# Altium schematic sheet AVR Board 4.0 FTDI USB.SchDoc
size B
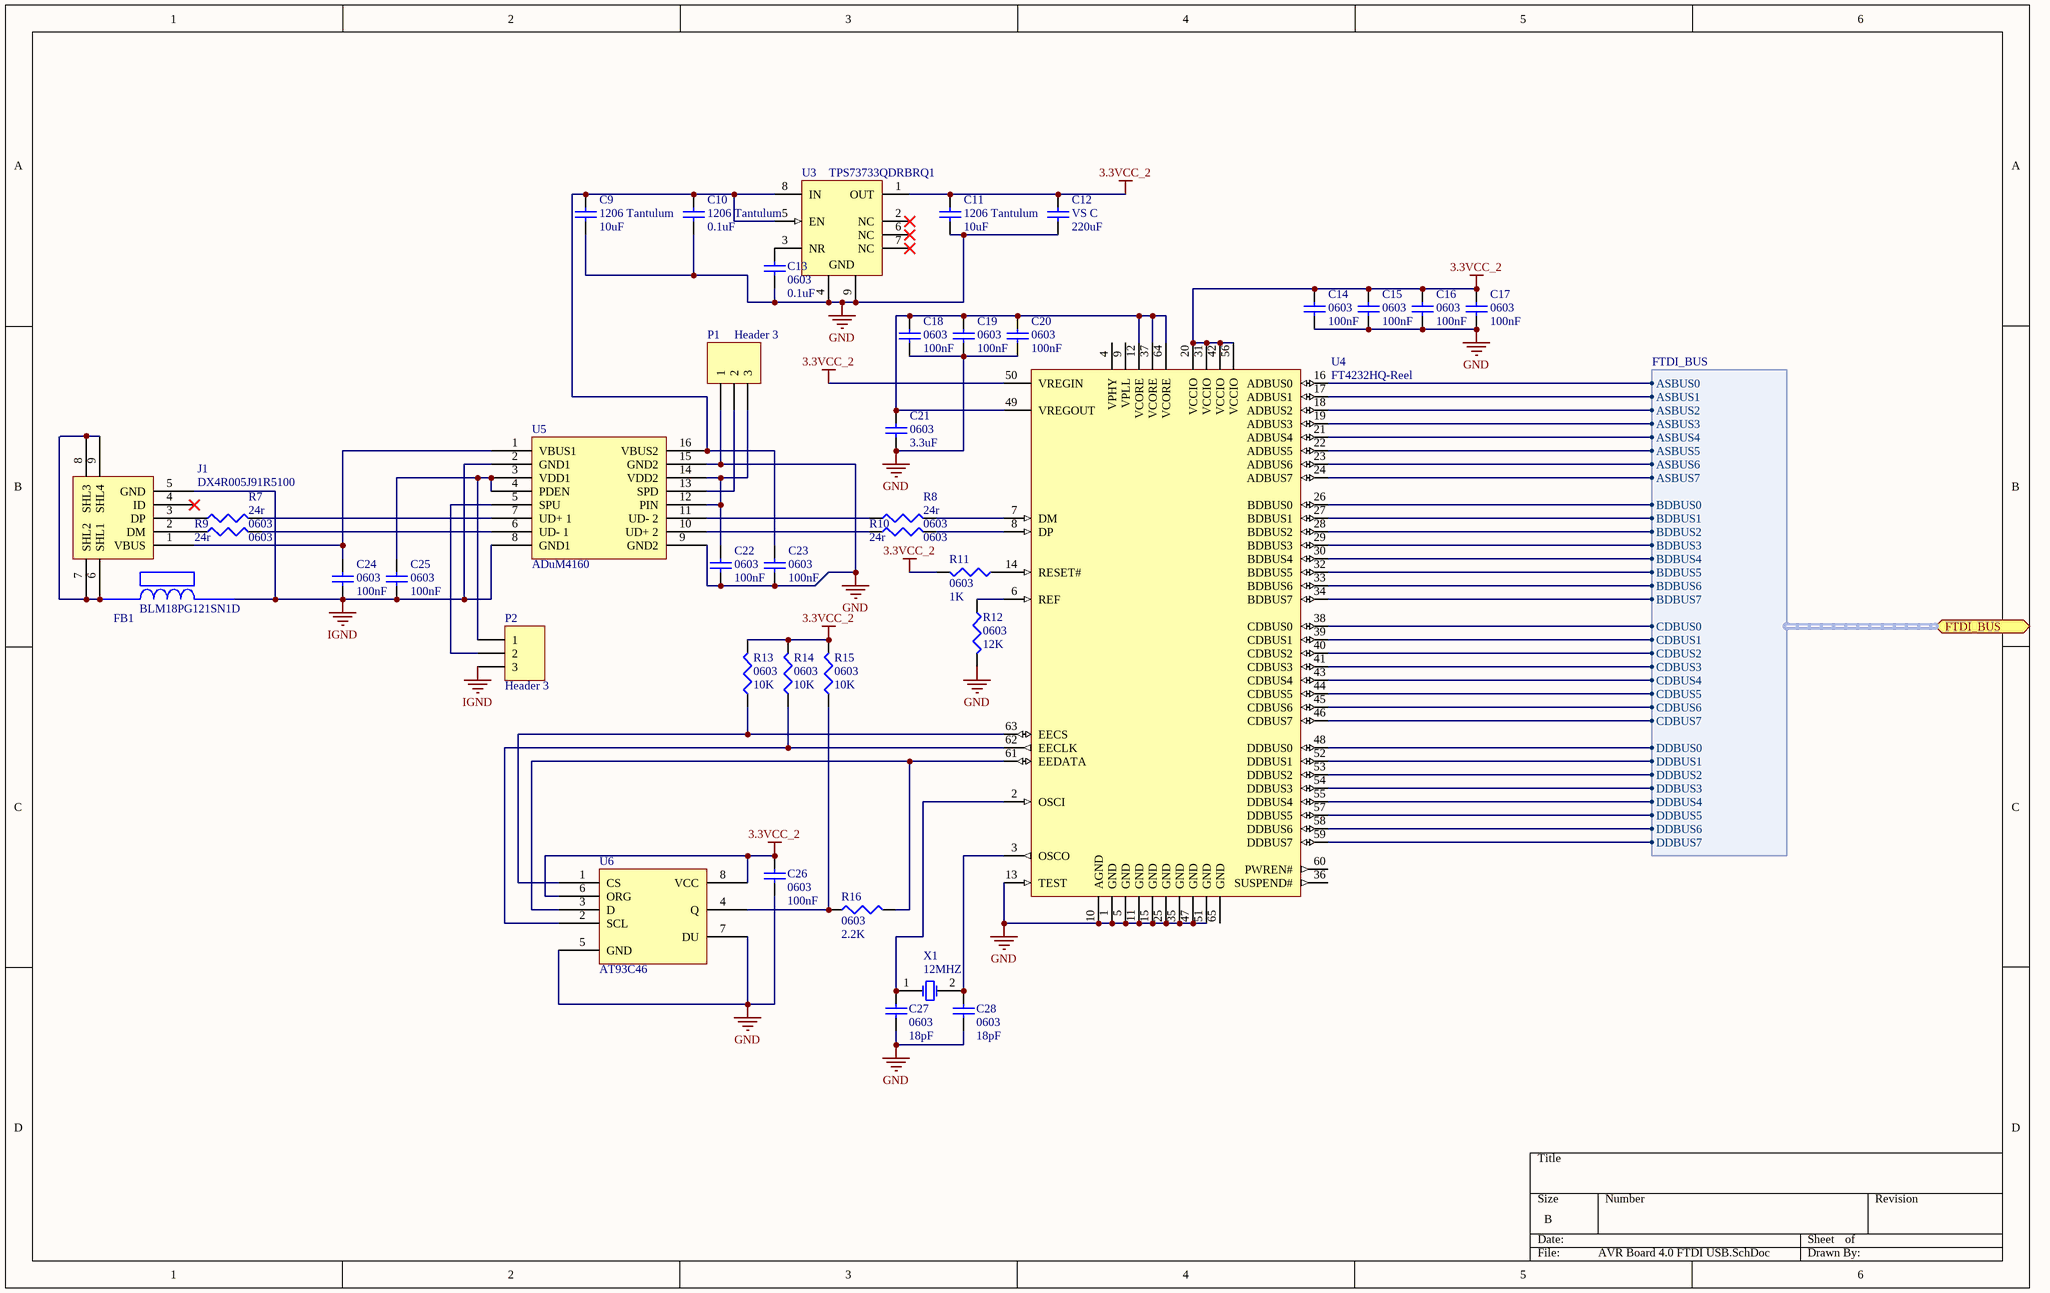
[diagram p0: AVR Board 4.0 FTDI USB.SchDoc]

## Parts
C9  1206 Tantulum  value 10uF  [C1206]
C10  1206 Tantulum  value 0.1uF  [C1206]
C11  1206 Tantulum  value 10uF  [C1206]
C12  VS C  value 220uF  [Panasonic VS C]
C13  0603  value 0.1uF  [1608[0603]]
C14  0603  value 100nF  [1608[0603]]
C15  0603  value 100nF  [1608[0603]]
C16  0603  value 100nF  [1608[0603]]
C17  0603  value 100nF  [1608[0603]]
C18  0603  value 100nF  [1608[0603]]
C19  0603  value 100nF  [1608[0603]]
C20  0603  value 100nF  [1608[0603]]
C21  0603  value 3.3uF  [1608[0603]]
C22  0603  value 100nF  [1608[0603]]
C23  0603  value 100nF  [1608[0603]]
C24  0603  value 100nF  [1608[0603]]
C25  0603  value 100nF  [1608[0603]]
C26  0603  value 100nF  [1608[0603]]
C27  0603  value 18pF  [1608[0603]]
C28  0603  value 18pF  [1608[0603]]
FB1  BLM18PG121SN1D  [BLM18PG121SN1D]
J1  DX4R005J91R5100  [Micro USB Circular Holes Only]
P1  Header 3  [HDR1X3]
P2  Header 3  [HDR1X3]
R7  0603  value 24r  [J1-0603]
R8  0603  value 24r  [J1-0603]
R9  0603  value 24r  [J1-0603]
R10  0603  value 24r  [J1-0603]
R11  0603  value 1K  [J1-0603]
R12  0603  value 12K  [J1-0603]
R13  0603  value 10K  [J1-0603]
R14  0603  value 10K  [J1-0603]
R15  0603  value 10K  [J1-0603]
R16  0603  value 2.2K  [J1-0603]
U3  TPS73733QDRBRQ1  [TI-DRB8-1750X1500TP_V]
U4  FT4232HQ-Reel  [QFN64_2_N]
U5  ADuM4160  [ADuM4160]
U6  AT93C46  [SOIC127P600X175-8N]
X1  12MHZ  [radial 4.88]

## Ports
FTDI_BUS (harness FTDI_BUS)

## Harnesses
FTDI_BUS: ASBUS0, ASBUS1, ASBUS2, ASBUS3, ASBUS4, ASBUS5, ASBUS6, ASBUS7, BDBUS0, BDBUS1, BDBUS2, BDBUS3, BDBUS4, BDBUS5, BDBUS6, BDBUS7, CDBUS0, CDBUS1, CDBUS2, CDBUS3, CDBUS4, CDBUS5, CDBUS6, CDBUS7, DDBUS0, DDBUS1, DDBUS2, DDBUS3, DDBUS4, DDBUS5, DDBUS6, DDBUS7

## Nets
3.3VCC_2: C11.1 C12.1 C14.2 C15.2 C16.2 C17.2 C26.2 R11.2 R13.2 R14.2 R15.2 U3.1(OUT) U4.20(VCCIO) U4.31(VCCIO) U4.42(VCCIO) U4.50(VREGIN) U4.56(VCCIO) U6.6(ORG) U6.8(VCC)
GND: C9.2 C10.1 C11.2 C12.2 C13.1 C14.1 C15.1 C16.1 C17.1 C18.1 C19.1 C20.1 C21.1 C22.1 C23.1 C26.1 C27.1 C28.1 P1.1 R12.2 U3.4(GND) U3.9(GND) U4.1(GND) U4.5(GND) U4.10(AGND) U4.11(GND) U4.13(TEST) U4.15(GND) U4.25(GND) U4.35(GND) U4.47(GND) U4.51(GND) U5.9(GND2) U5.15(GND2) U6.5(GND) U6.7(DU)
IGND: C24.1 C25.1 FB1.2 J1.5(GND) P2.3 U5.2(GND1) U5.8(GND1)
NetC9_1: C9.1 C10.2 C23.2 U3.5(EN) U3.8(IN) U5.16(VBUS2)
NetC13_2: C13.2 U3.3(NR)
NetC18_2: C18.2 C19.2 C20.2 C21.2 U4.12(VCORE) U4.37(VCORE) U4.49(VREGOUT) U4.64(VCORE)
NetC22_2: C22.2 P1.3 U5.12(PIN) U5.14(VDD2)
NetC24_2: C24.2 J1.1(VBUS) U5.1(VBUS1)
NetC25_2: C25.2 P2.1 U5.3(VDD1) U5.4(PDEN)
NetC27_2: C27.2 U4.2(OSCI) X1.1(OSC1)
NetC28_2: C28.2 U4.3(OSCO) X1.2(OSC2)
NetFB1_1: FB1.1 J1.6(SHL1) J1.7(SHL2) J1.8(SHL3) J1.9(SHL4)
NetJ1_2: J1.2(DM) R9.1
NetJ1_3: J1.3(DP) R7.1
NetP1_2: P1.2 U5.13(SPD)
NetP2_2: P2.2 U5.5(SPU)
NetR7_2: R7.2 U5.7(UD+_1)
NetR8_1: R8.1 U5.11(UD-_2)
NetR8_2: R8.2 U4.7(DM)
NetR9_2: R9.2 U5.6(UD-_1)
NetR10_1: R10.1 U5.10(UD+_2)
NetR10_2: R10.2 U4.8(DP)
NetR11_1: R11.1 U4.14(RESET#)
NetR12_1: R12.1 U4.6(REF)
NetR13_1: R13.1 U4.63(EECS) U6.1(CS)
NetR14_1: R14.1 U4.62(EECLK) U6.2(SCL)
NetR15_1: R15.1 R16.1 U6.4(Q)
NetR16_2: R16.2 U4.61(EEDATA) U6.3(D)
NetU4_16: U4.16(ADBUS0) ; port FTDI_BUS.ASBUS0
NetU4_17: U4.17(ADBUS1) ; port FTDI_BUS.ASBUS1
NetU4_18: U4.18(ADBUS2) ; port FTDI_BUS.ASBUS2
NetU4_19: U4.19(ADBUS3) ; port FTDI_BUS.ASBUS3
NetU4_21: U4.21(ADBUS4) ; port FTDI_BUS.ASBUS4
NetU4_22: U4.22(ADBUS5) ; port FTDI_BUS.ASBUS5
NetU4_23: U4.23(ADBUS6) ; port FTDI_BUS.ASBUS6
NetU4_24: U4.24(ADBUS7) ; port FTDI_BUS.ASBUS7
NetU4_26: U4.26(BDBUS0) ; port FTDI_BUS.BDBUS0
NetU4_27: U4.27(BDBUS1) ; port FTDI_BUS.BDBUS1
NetU4_28: U4.28(BDBUS2) ; port FTDI_BUS.BDBUS2
NetU4_29: U4.29(BDBUS3) ; port FTDI_BUS.BDBUS3
NetU4_30: U4.30(BDBUS4) ; port FTDI_BUS.BDBUS4
NetU4_32: U4.32(BDBUS5) ; port FTDI_BUS.BDBUS5
NetU4_33: U4.33(BDBUS6) ; port FTDI_BUS.BDBUS6
NetU4_34: U4.34(BDBUS7) ; port FTDI_BUS.BDBUS7
NetU4_38: U4.38(CDBUS0) ; port FTDI_BUS.CDBUS0
NetU4_39: U4.39(CDBUS1) ; port FTDI_BUS.CDBUS1
NetU4_40: U4.40(CDBUS2) ; port FTDI_BUS.CDBUS2
NetU4_41: U4.41(CDBUS3) ; port FTDI_BUS.CDBUS3
NetU4_43: U4.43(CDBUS4) ; port FTDI_BUS.CDBUS4
NetU4_44: U4.44(CDBUS5) ; port FTDI_BUS.CDBUS5
NetU4_45: U4.45(CDBUS6) ; port FTDI_BUS.CDBUS6
NetU4_46: U4.46(CDBUS7) ; port FTDI_BUS.CDBUS7
NetU4_48: U4.48(DDBUS0) ; port FTDI_BUS.DDBUS0
NetU4_52: U4.52(DDBUS1) ; port FTDI_BUS.DDBUS1
NetU4_53: U4.53(DDBUS2) ; port FTDI_BUS.DDBUS2
NetU4_54: U4.54(DDBUS3) ; port FTDI_BUS.DDBUS3
NetU4_55: U4.55(DDBUS4) ; port FTDI_BUS.DDBUS4
NetU4_57: U4.57(DDBUS5) ; port FTDI_BUS.DDBUS5
NetU4_58: U4.58(DDBUS6) ; port FTDI_BUS.DDBUS6
NetU4_59: U4.59(DDBUS7) ; port FTDI_BUS.DDBUS7

Not connected (* = marked no-connect by the designer): J1 4(ID)*; U3 2(NC)* 6(NC)* 7(NC)*; U4 4(VPHY) 9(VPLL) 36(SUSPEND#) 60(PWREN#) 65(GND)

## Library data of the parts
C9-C28 = Cap Semi: Capacitor (Semiconductor SIM Model); Published: 8-Jun-2000; LatestRevisionDate: 29-May-2009; LatestRevisionNote: IPC-7351 Footprint Added.; PackageReference: C1206; Publisher: Altium Limited; PackageDescription: Chip Capacitor
J1 = Micro USB: Micro USB Jack B
P1 P2 = Header 3: Header, 3-Pin; LatestRevisionDate: 17-Jul-2002; LatestRevisionNote: Re-released for DXP Platform.; Publisher: Altium Limited
R7-R16 = Res3: Resistor; Published: 8-Jun-2000; LatestRevisionDate: 29-May-2009; LatestRevisionNote: IPC-7351 Footprint Added.; PackageReference: J1-0603; Publisher: Altium Limited; PackageDescription: Chip Resistor
U3 = TPS73733QDRBRQ1: Single Output Automotive LDO, 1 A, Fixed 3.3 V Output, 2.2 to 5.5 V Input, with Reverse Current Protection, 8-pin SON (DRB), -40 to 125 degC, Green (RoHS & no Sb/Br); Manufacturer: Texas Instruments; Accuracy(%): 3; Fixed Output Options(V): 3.3; Iout(Max)(A): 1; Iq(Typ)(mA): 0.3; SubFamily: Single Channel LDO; Vdo(Typ)(mV): 130; Vin(Max)(V): 5.5; Vin(Min)(V): 2.2; DatasheetVersion: SBVS123; PackageVersion: 4203482-2/K; PackageReference: DRB8-1750X1500TP; PackageDescription: 8-Pin Plastic Small Outline, Body 3 x 3 mm, Pitch 0.65 mm; Supplier 1: Digi-Key; Supplier Part Number 1: 296-24157-2-ND; Supplier 2: Digi-Key; Supplier Part Number 2: 296-24157-1-ND; Supplier 3: Digi-Key; Supplier Part Number 3: 296-24157-6-ND; Supplier 4: Newark; Supplier Part Number 4: 56P3118; Supplier 5: Mouser; Supplier Part Number 5: 595-TPS73733QDRBRQ1; Eco-Plan: Green (RoHS & no Sb/Br); Rating: Automotive; Vout Adj(Max)(V): 3.3; Vout Adj(Min)(V): 3.3; Mounting Technology: Surface Mount; PartNumber: TPS73733QDRBRQ1; ComponentLink1Description: Manufacturer URL; ComponentLink1URL: http://www.ti.com/; ComponentLink2Description: Datasheet; ComponentLink2URL: http://www.ti.com/general/docs/lit/getliterature.tsp?genericPartNumber=TPS73733-Q1&fileType=pdf; ComponentLink3Description: Package Specification; ComponentLink3URL: http://www.ti.com/litv/pdf/mpds118h
U4 = FT4232HQ-Reel: Quad High Speed USB To Multipurpose UART/MPSSE IC, 64-pin QFN, Tape and Reel; Manufacturer: FTDI; DatasheetVersion: ver 2.2, Jan-2012; PackageVersion: Jan-12; PackageReference: QFN64_2; PackageDescription: 64-Pin Quad Flat No-Lead, 9 x 9 mm Body, 0.5 mm Pitch, 4.35 x 4.35 mm Exposed Pad; PartNumber: FT4232HQ-Reel; ComponentLink1Description: Manufacturer URL; ComponentLink1URL: http://www.ftdichip.com/; ComponentLink2Description: Datasheet; ComponentLink2URL: http://www.ftdichip.com/Support/Documents/DataSheets/ICs/DS_FT4232H.pdf
U5 = ADuM4160: USB Opto Isolator
X1 = XTAL: Crystal Oscillator; Published: 8-Jun-2000; LatestRevisionDate: 17-Jul-2002; LatestRevisionNote: Re-released for DXP Platform.; PackageReference: R38; Publisher: Altium Limited; PackageDescription: Crystal, Thru-Hole; 2 Leads; Body 3.1 x 8.2 mm (Dia.xH)